# EAGLE design RS485auto (EAGLE 5.06)
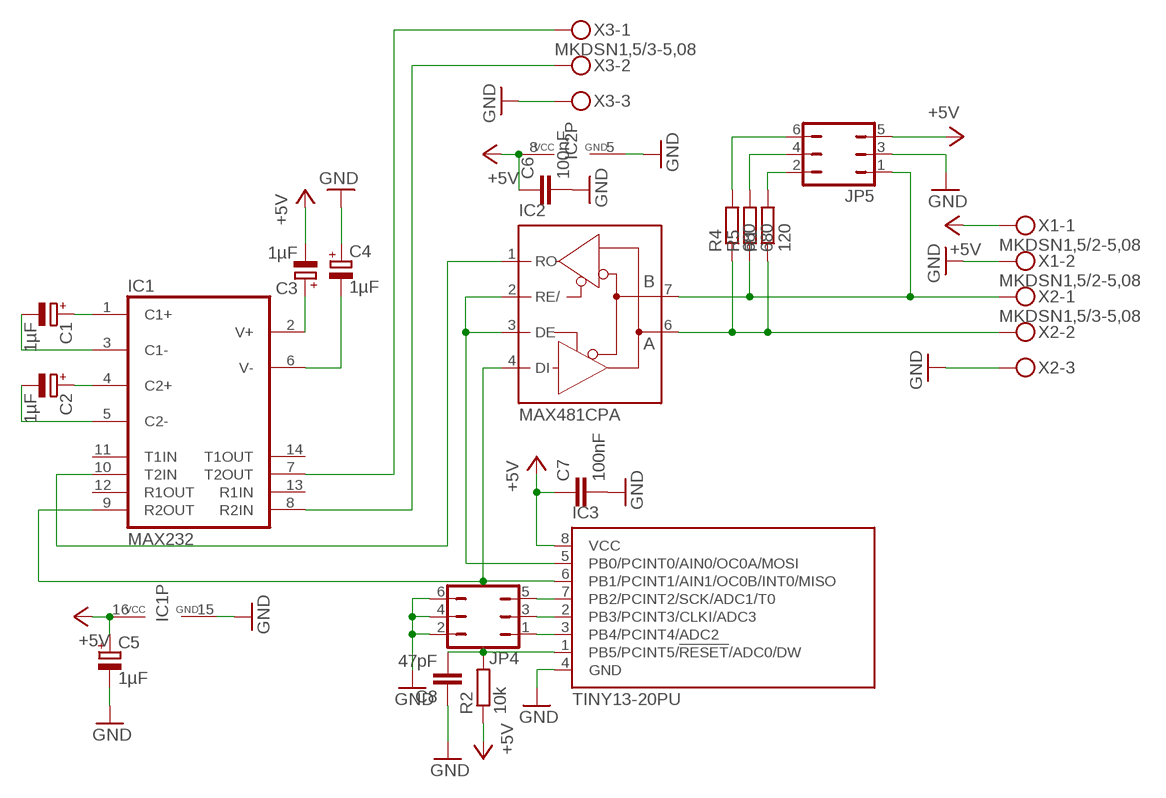
[diagram p0: schematic, sheet 1]

## Parts
C1  1µF  CPOL-EUE2.5-6  [E2,5-6]
C2  1µF  CPOL-EUE2.5-6  [E2,5-6]
C3  1µF  CPOL-EUE2.5-6  [E2,5-6]
C4  1µF  CPOL-EUE2.5-6  [E2,5-6]
C5  1µF  CPOL-EUE2.5-6  [E2,5-6]
C6  100nF  C-EU025-025X050  [C025-025X050]
C7  100nF  C-EU025-025X050  [C025-025X050]
C8  47pF  C-EU025-025X050  [C025-025X050]
IC1  MAX232  [DIL16]
IC2  MAX481CPA  [DIL08]
IC3  TINY13-20PU  [DIL08]
JP4  JP3Q  [JP3Q]
JP5  JP3Q  [JP3Q]
R1  120  R-EU_0207/10  [0207/10]
R2  10k  R-EU_0207/10  [0207/10]
R4  680  R-EU_0207/10  [0207/10]
R5  680  R-EU_0207/10  [0207/10]
X1  MKDSN1,5/2-5,08  [MKDSN1,5/2-5,08]
X2  MKDSN1,5/3-5,08  [MKDSN1,5/3-5,08]
X3  MKDSN1,5/3-5,08  [MKDSN1,5/3-5,08]

## Nets
+5V: C3.- C5.+ C6.1 C7.1 IC1.16(VCC) IC2.8(VCC) IC3.8(VCC) JP5.5 R2.1 X1.1
GND: C4.+ C5.- C6.2 C7.2 C8.1 IC1.15(GND) IC2.5(GND) IC3.4(GND) JP4.2 JP4.4 JP4.6 JP5.3 X1.2 X2.3 X3.3
N$1: C1.+ IC1.1(C1+)
N$2: C1.- IC1.3(C1-)
N$3: C2.+ IC1.4(C2+)
N$4: C2.- IC1.5(C2-)
N$5: C3.+ IC1.2(V+)
N$6: C4.- IC1.6(V-)
N$7: IC3.7(PB2/PCINT2/SCK/ADC1/T0) JP4.5
N$8: IC2.6(A) R1.1 R4.1 X2.2
N$9: IC2.7(B) JP5.1 R5.1 X2.1
N$10: JP5.2 R1.2
N$11: IC1.7(T2OUT) X3.1
N$12: IC2.2(RE/) IC2.3(DE) IC3.5(PB0/PCINT0/AIN0/OC0A/MOSI)
N$13: IC1.10(T2IN) IC2.1(RO)
N$14: IC1.9(R2OUT) IC2.4(DI) IC3.6(PB1/PCINT1/AIN1/OC0B/INT0/MISO)
N$15: IC3.2(PB3/PCINT3/CLKI/ADC3) JP4.3
N$16: IC1.8(R2IN) X3.2
N$17: IC3.3(PB4/PCINT4/ADC2) JP4.1
N$18: JP5.6 R4.2
N$19: JP5.4 R5.2
N$22: C8.2 IC3.1(PB5/PCINT5/!RESET!/ADC0/DW) R2.2
Unconnected: IC1.11(T1IN) IC1.12(R1OUT) IC1.13(R1IN) IC1.14(T1OUT)

## Library data of the parts
C1-C5 = rcl:CPOL-EU: POLARIZED CAPACITOR, European symbol
C6-C8 = rcl:C-EU: CAPACITOR, European symbol
IC1 = maxim:MAX232: RS232 TRANSEIVER
IC2 = maxim:MAX481CPA: RS485 TRANSEIVER
IC3 = atmel:TINY13: 8-bit AVR Microcontroller with 1K Bytes In-System Programmable Flash Source: http://www.atmel.com/dyn/resources/prod_documents/2535S.pdf
JP4 JP5 = jumper:JP3Q: JUMPER
R1 R2 R4 R5 = rcl:R-EU_: RESISTOR, European symbol
X1 = con-phoenix-508:MKDSN1,5/2-5,08: MKDSN 1,5/ 2-5,08 Printklemme Nennstrom: 13,5 A Nennspannung: 250 V Rastermaß: 5,08 mm Polzahl: 2 Anschlussart: Schraubanschluss Montage: Löten Anschlussrichtung Leiter/Platine: 0 ° Artikelnummer: 1729128 Source: http://eshop.phoenixcontact.com .. 1729128.pdf
X2 X3 = con-phoenix-508:MKDSN1,5/3-5,08: MKDSN 1,5/ 3-5,08 Printklemme Nennstrom: 13,5 A Nennspannung: 250 V Rastermaß: 5,08 mm Polzahl: 3 Anschlussart: Schraubanschluss Montage: Löten Anschlussrichtung Leiter/Platine: 0 ° Artikelnummer: 1729131 Source: http://eshop.phoenixcontact.com .. 1729131.pdf

## Board
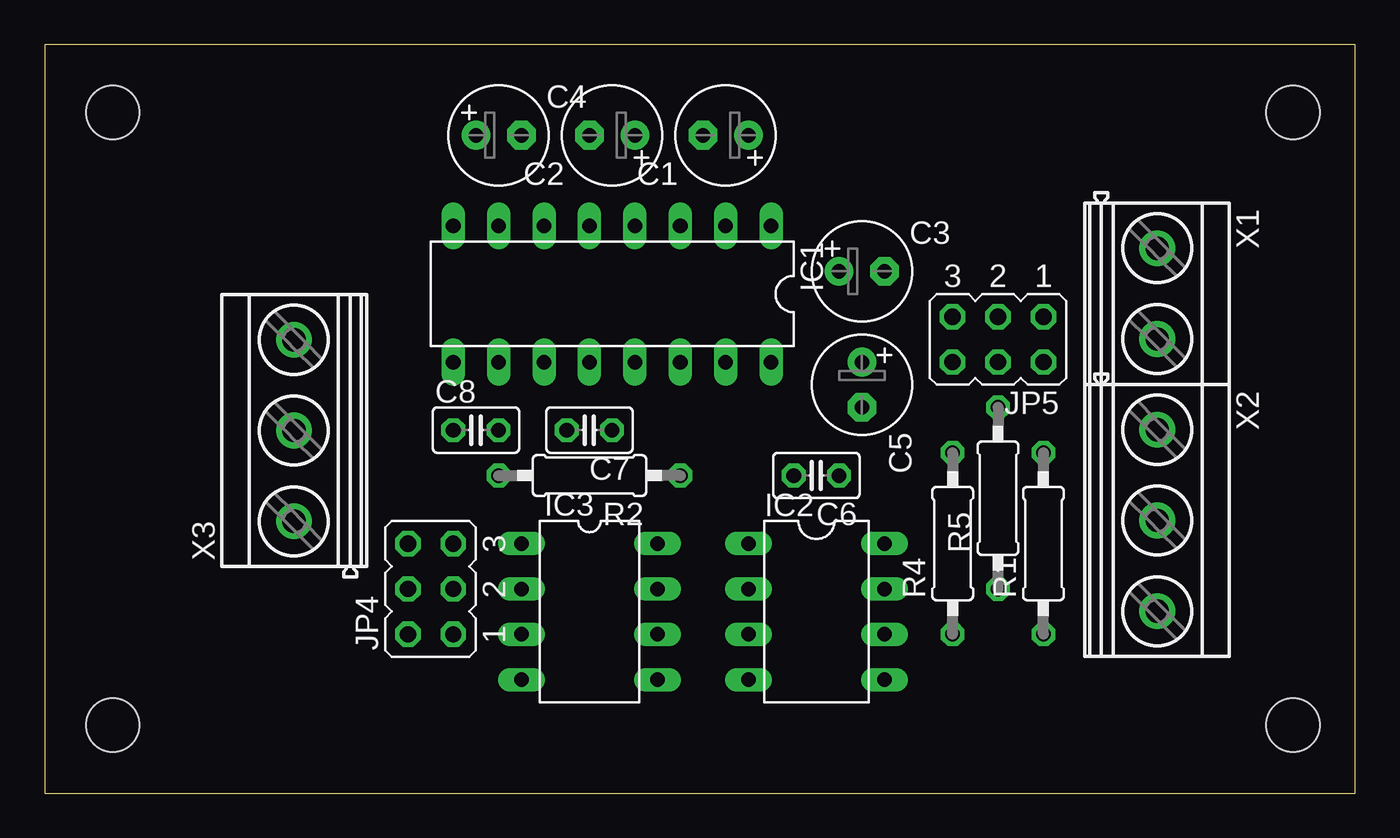
[diagram p1: board, top side]
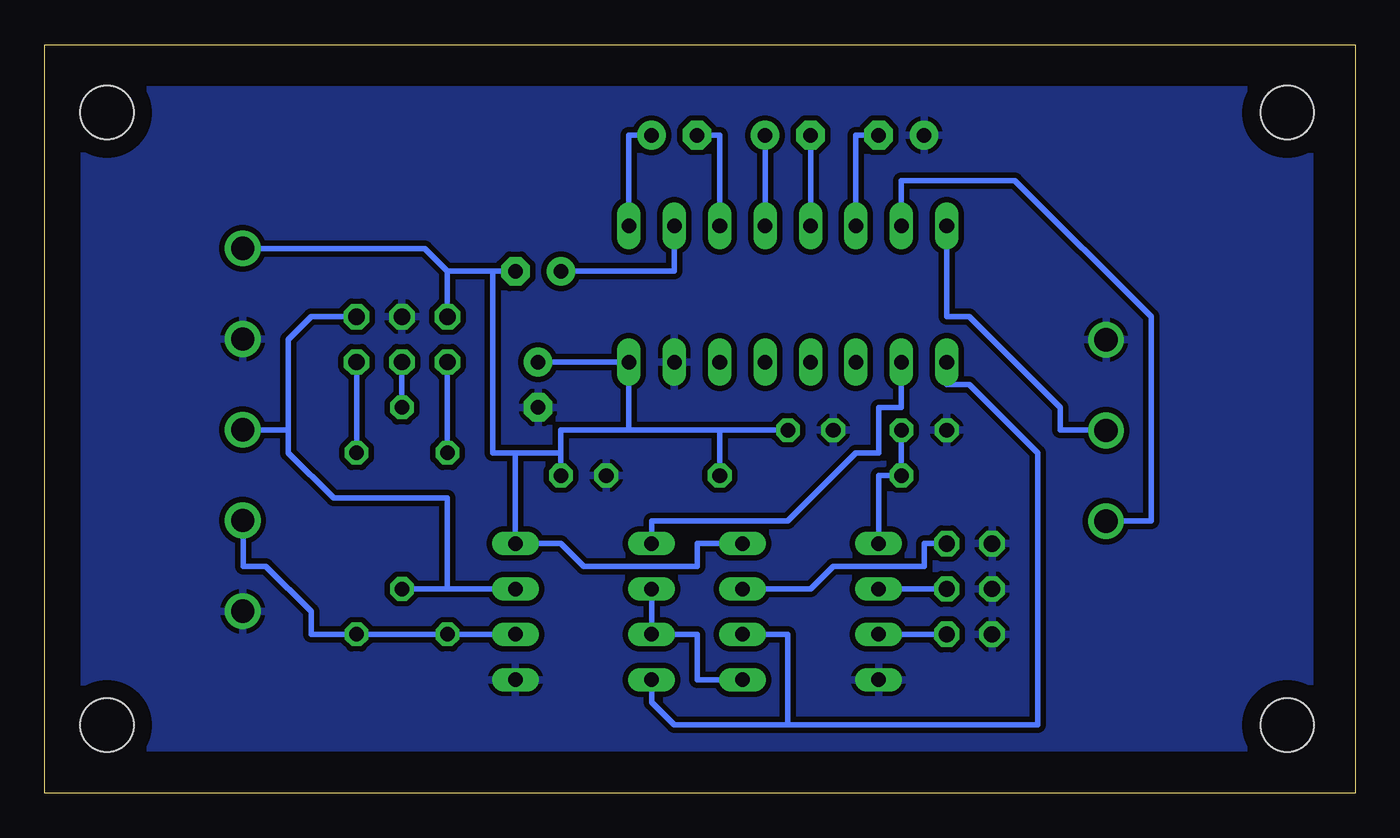
[diagram p2: board, bottom side, seen from below]

Size 73.33 x 41.9 mm. Coordinates in mm from the lower left corner, seen from the top.
Outline: 0,0 73.33,0 73.33,41.9 0,41.9 0,0
Copper layers (1*16): Top 0.035mm / dielectric 1.5mm / Bottom 0.035mm
Design rules "default *": minimum track width 12mil, minimum drill 24mil, track to track 12mil, track to pad 12mil, pad to pad 12mil, via to via 12mil, smd to smd 8mil, copper to edge 40mil, drill to drill 8mil, minimum pad ring 10mil, minimum via ring 8mil, stop-mask expansion 4mil, vias tented up to drill 0mil, thermal gap 10mil
Holes 3 mm at 3.81,3.81 3.81,38.1 69.85,38.1 69.85,3.81

### Footprints (pad centres in the part's own frame; a part is rotated, then mirrored left to right if it is on the bottom)
E2,5-6 = drill 0.813 pad 1.6 round: + -1.27,0 | drill 0.813 pad 1.6 octagon: - 1.27,0
C025-025X050 = drill 0.813 octagon: 1 -1.27,0; 2 1.27,0
DIL16 = drill 0.813 long: 1 -8.89,-3.81; 2 -6.35,-3.81; 3 -3.81,-3.81; 4 -1.27,-3.81; 5 1.27,-3.81; 6 3.81,-3.81; 7 6.35,-3.81; 8 8.89,-3.81; 9 8.89,3.81; 10 6.35,3.81; 11 3.81,3.81; 12 1.27,3.81; 13 -1.27,3.81; 14 -3.81,3.81; 15 -6.35,3.81; 16 -8.89,3.81
DIL08 = drill 0.813 long: 1 -3.81,-3.81; 2 -1.27,-3.81; 3 1.27,-3.81; 4 3.81,-3.81; 5 3.81,3.81; 6 1.27,3.81; 7 -1.27,3.81; 8 -3.81,3.81
JP3Q = drill 0.914 octagon: 1 -2.54,-1.27; 2 -2.54,1.27; 3 0,-1.27; 4 0,1.27; 5 2.54,-1.27; 6 2.54,1.27
0207/10 = drill 0.813 octagon: 1 -5.08,0; 2 5.08,0
MKDSN1,5/2-5,08 = drill 1.3 pad 2 round: 1 -2.561,0.025; 2 2.519,0.025
MKDSN1,5/3-5,08 = drill 1.3 pad 2 round: 1 -7.641,0.025; 2 -2.561,0.025; 3 2.519,0.025

### Placement (x,y rotation side)
C1  38.1,36.83 180 top
C2  31.75,36.83 180 top
C3  45.72,29.21 0 top
C4  25.4,36.83 0 top
C5  45.72,22.86 270 top
C6  43.18,17.78 180 top
C7  30.48,20.32 180 top
C8  24.13,20.32 0 top
IC1  31.75,27.94 180 top
IC2  43.18,10.16 270 top
IC3  30.48,10.16 270 top
JP4  21.59,11.43 90 top
JP5  53.34,25.4 180 top
R1  55.88,13.97 90 top
R2  30.48,17.78 180 top
R4  50.8,13.97 90 top
R5  53.34,16.51 90 top
X1  62.23,27.94 270 top
X2  62.23,12.7 270 top
X3  13.97,22.86 90 top

### Tracks (layer width: path | path; a pad name or v marks a point on that pad's centre or on a via)
+5V
  Bottom 0.305: 50.8,29.21 JP5.5 | 48.26,29.21 C3.- | 48.26,29.21 50.8,29.21 | 50.8,29.21 52.07,30.48 62.23,30.48 X1.1 | IC3.8 36.83,13.97 36.83,12.7 43.18,12.7 44.45,13.97 IC2.8 46.99,19.05 | 35.56,20.32 R2.1 | 35.56,20.32 C7.1 | 40.64,20.32 IC1.16 C5.+ | 40.64,20.32 35.56,20.32 | 44.45,19.05 44.45,20.32 40.64,20.32 | 44.45,19.05 C6.1 | 46.99,19.05 44.45,19.05 | 48.26,29.21 48.26,19.05 46.99,19.05
GND
  pour Bottom: 2.54,39.37 71.12,39.37 71.12,2.54 2.54,2.54
N$1
  Bottom 0.305: IC1.1 40.64,36.83 C1.+
N$2
  Bottom 0.305: IC1.3 35.56,36.83 C1.-
N$3
  Bottom 0.305: IC1.4 C2.+
N$4
  Bottom 0.305: IC1.5 C2.-
N$5
  Bottom 0.305: IC1.2 38.1,29.21 C3.+
N$6
  Bottom 0.305: IC1.6 27.94,36.83 C4.-
N$7
  Bottom 0.305: IC3.7 30.48,11.43 29.21,12.7 24.13,12.7 24.13,13.97 JP4.5
N$8
  Bottom 0.305: IC2.6 R4.1 R1.1 58.42,8.89 58.42,10.16 60.96,12.7 62.23,12.7 62.23,15.24 X2.2
N$9
  Bottom 0.305: 50.8,11.43 R5.1 | IC2.7 50.8,11.43 | JP5.1 58.42,26.67 59.69,25.4 59.69,20.32 | 59.69,20.32 62.23,20.32 X2.1 | 50.8,11.43 50.8,16.51 57.15,16.51 59.69,19.05 59.69,20.32
N$10
  Bottom 0.305: R1.2 JP5.2
N$11
  Bottom 0.305: IC1.7 25.4,34.29 19.05,34.29 11.43,26.67 11.43,15.24 13.97,15.24 X3.1
N$12
  Bottom 0.305: IC3.5 36.83,6.35 36.83,8.89 IC2.3 IC2.2
N$13
  Bottom 0.305: IC1.10 25.4,21.59 26.67,21.59 26.67,19.05 27.94,19.05 31.75,15.24 39.37,15.24 IC2.1
N$14
  Bottom 0.305: IC3.6 31.75,8.89 31.75,3.81 | 31.75,3.81 38.1,3.81 39.37,5.08 IC2.4 | IC1.9 22.86,22.86 21.59,22.86 17.78,19.05 17.78,3.81 31.75,3.81
N$15
  Bottom 0.305: JP4.3 IC3.2
N$16
  Bottom 0.305: IC1.8 22.86,26.67 21.59,26.67 16.51,21.59 16.51,20.32 13.97,20.32 X3.2
N$17
  Bottom 0.305: JP4.1 IC3.3
N$18
  Bottom 0.305: R4.2 JP5.6
N$19
  Bottom 0.305: R5.2 JP5.4
N$22
  Bottom 0.305: IC3.1 26.67,17.78 R2.2 C8.2